# EAGLE schematic cc2538-dev-v1 (EAGLE 7.1.0)
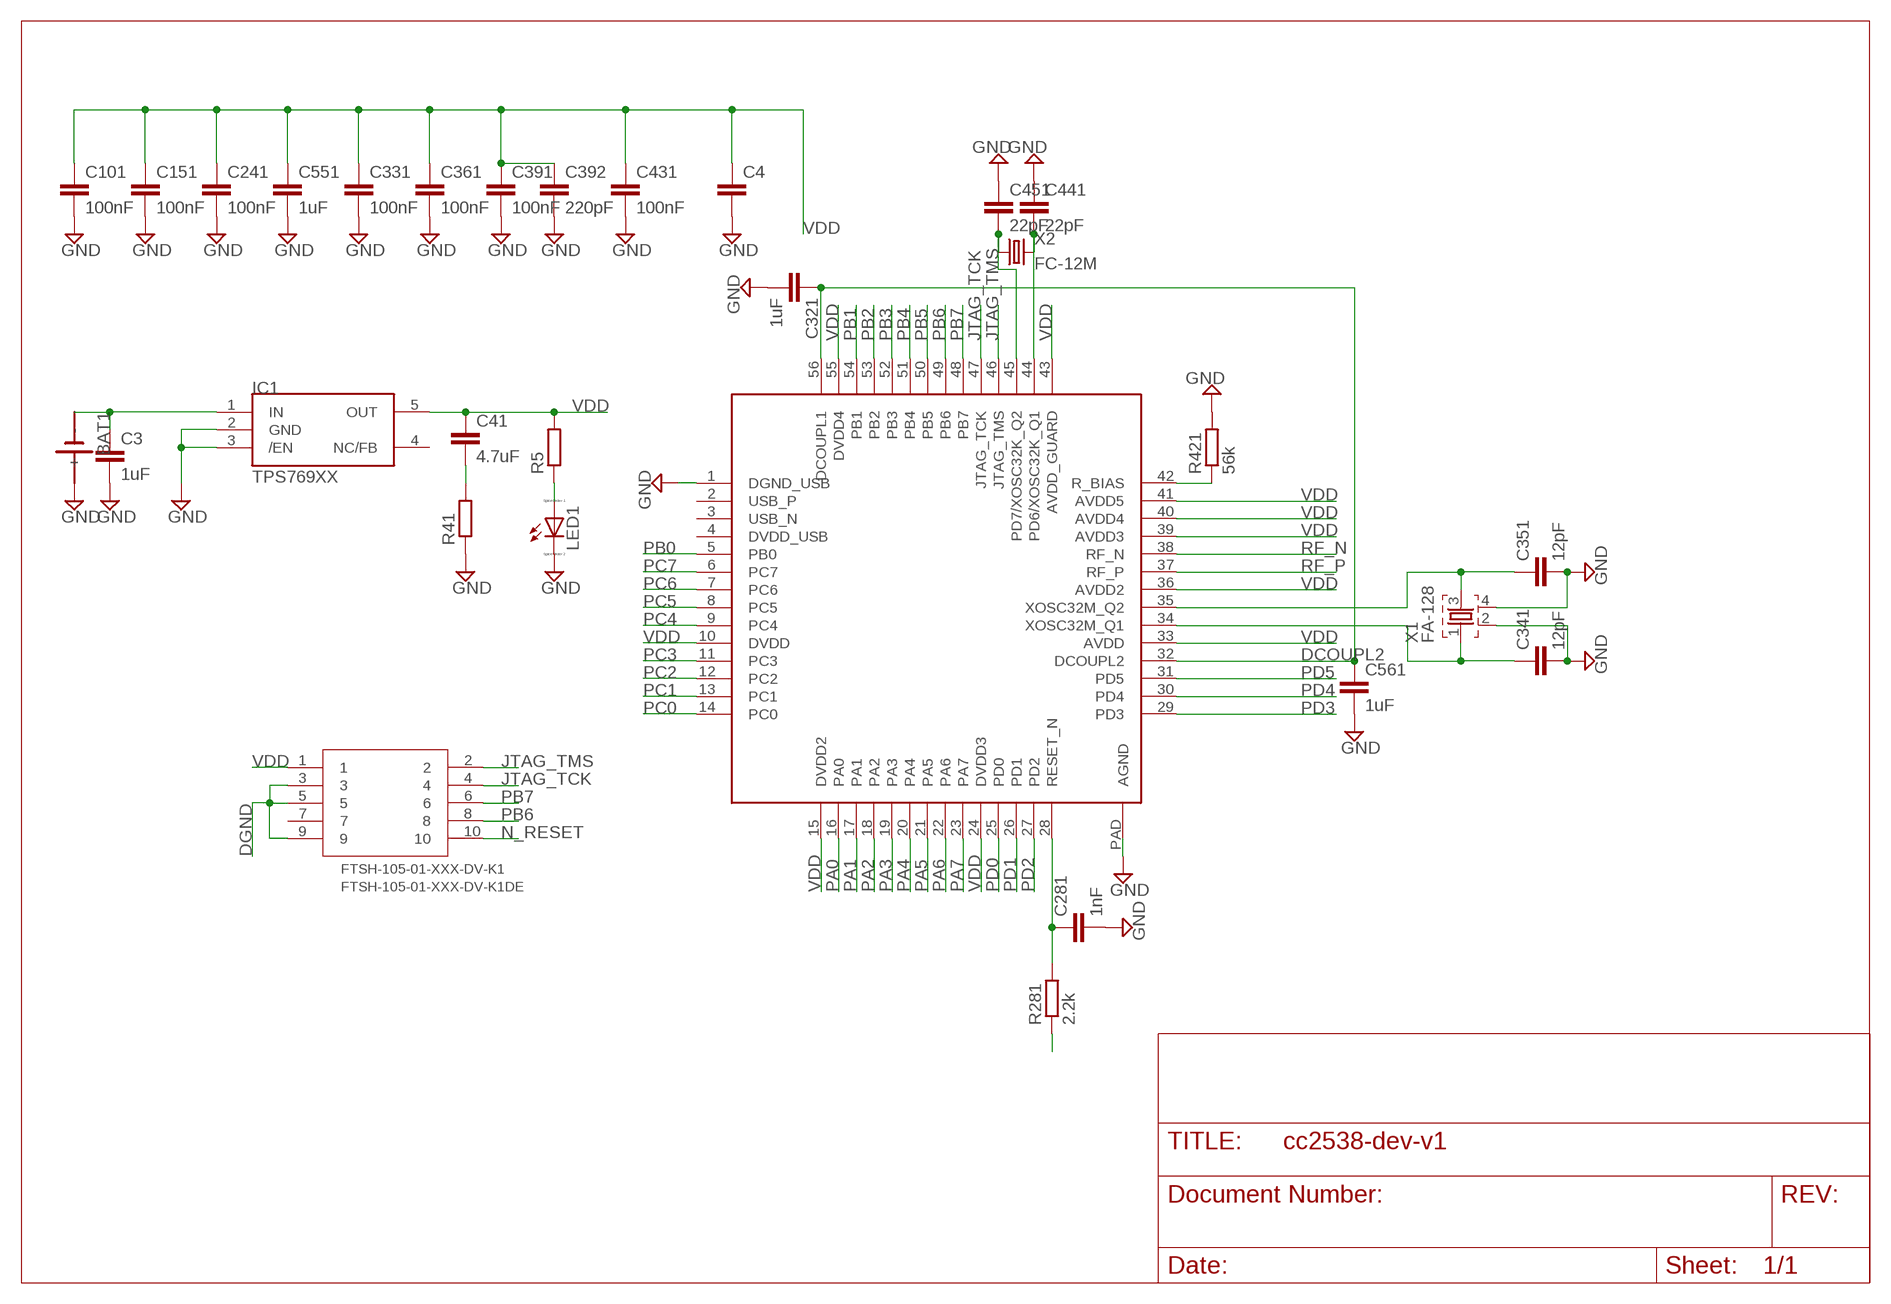
[diagram p0: schematic, sheet 1]

## Parts
BAT1  SN2032  [SN2032]
C3  1uF  C-EUC0603  [C0603]
C4  C-EUC0603  [C0603]
C41  4.7uF  C-EUC0603  [C0603]
C101  100nF  C-EUC0402  [C0402]
C151  100nF  C-EUC0402  [C0402]
C241  100nF  C-EUC0402  [C0402]
C281  1nF  C-EUC0402  [C0402]
C321  1uF  C-EUC0402  [C0402]
C331  100nF  C-EUC0402  [C0402]
C341  12pF  C-EUC0402  [C0402]
C351  12pF  C-EUC0402  [C0402]
C361  100nF  C-EUC0402  [C0402]
C391  100nF  C-EUC0402  [C0402]
C392  220pF  C-EUC0402  [C0402]
C431  100nF  C-EUC0402  [C0402]
C441  22pF  C-EUC0402  [C0402]
C451  22pF  C-EUC0402  [C0402]
C551  1uF  C-EUC0402  [C0402]
C561  1uF  C-EUC0402  [C0402]
FTSH-105-01-XXX-DV-K1  FTSH-105-01-XXX-DV-K1DE  [FTSH-105-01-XXX-DV-K]
IC1  TPS769XX  [SOT23-5L]
LED1  LED_ESML0603  [LED_SML0603]
R5  R-EU_R0603  [R0603]
R41  R-EU_R0603  [R0603]
R281  2.2k  R-EU_R0402  [R0402]
R421  56k  R-EU_R0402  [R0402]
U1  CC2538  [QFN56]
X1  FA-128  [FA-128]
X2  FC-12M  [FC-12M]

## Nets
DCOUPL2: C321.1 C561.1 U1.32(DCOUPL2) U1.56(DCOUPL1)
DGND: FTSH-105-01-XXX-DV-K1.3 FTSH-105-01-XXX-DV-K1.5 FTSH-105-01-XXX-DV-K1.9
GND: BAT1.+ C3.2 C4.2 C101.2 C151.2 C241.2 C281.2 C321.2 C331.2 C341.2 C351.2 C361.2 C391.2 C392.2 C431.2 C441.1 C451.1 C551.2 C561.2 IC1.2(GND) IC1.3(/EN) LED1.C R41.1 R421.2 U1.1(DGND_USB) U1.PAD(AGND) X1.2 X1.4
JTAG_TCK: FTSH-105-01-XXX-DV-K1.4 U1.47(JTAG_TCK)
JTAG_TMS: FTSH-105-01-XXX-DV-K1.2 U1.46(JTAG_TMS)
N$7: R421.1 U1.42(R_BIAS)
N$8: C281.1 R281.2 U1.28(RESET_N)
N$9: C341.1 U1.34(XOSC32M_Q1) X1.1
N$10: C451.2 U1.45(PD7/XOSC32K_Q2) X2.1
N$11: C441.2 U1.44(PD6/XOSC32K_Q1) X2.2
N$16: C351.1 U1.35(XOSC32M_Q2) X1.3
N$18: C41.2 R41.2
N$20: LED1.A R5.1
N$21: BAT1.- C3.1 IC1.1(IN)
N_RESET: FTSH-105-01-XXX-DV-K1.10
NRESET: R281.1
PA0: U1.16(PA0)
PA1: U1.17(PA1)
PA2: U1.18(PA2)
PA3: U1.19(PA3)
PA4: U1.20(PA4)
PA5: U1.21(PA5)
PA6: U1.22(PA6)
PA7: U1.23(PA7)
PB0: U1.5(PB0)
PB1: U1.54(PB1)
PB2: U1.53(PB2)
PB3: U1.52(PB3)
PB4: U1.51(PB4)
PB5: U1.50(PB5)
PB6: FTSH-105-01-XXX-DV-K1.8 U1.49(PB6)
PB7: FTSH-105-01-XXX-DV-K1.6 U1.48(PB7)
PC0: U1.14(PC0)
PC1: U1.13(PC1)
PC2: U1.12(PC2)
PC3: U1.11(PC3)
PC4: U1.9(PC4)
PC5: U1.8(PC5)
PC6: U1.7(PC6)
PC7: U1.6(PC7)
PD0: U1.25(PD0)
PD1: U1.26(PD1)
PD2: U1.27(PD2)
PD3: U1.29(PD3)
PD4: U1.30(PD4)
PD5: U1.31(PD5)
RF_N: U1.38(RF_N)
RF_P: U1.37(RF_P)
VDD: C4.1 C41.1 C101.1 C151.1 C241.1 C331.1 C361.1 C391.1 C392.1 C431.1 C551.1 FTSH-105-01-XXX-DV-K1.1 IC1.5(OUT) R5.2 U1.10(DVDD) U1.15(DVDD2) U1.24(DVDD3) U1.33(AVDD) U1.36(AVDD2) U1.39(AVDD3) U1.40(AVDD4) U1.41(AVDD5) U1.43(AVDD_GUARD) U1.55(DVDD4)
Unconnected: IC1.4(NC/FB) U1.2(USB_P) U1.3(USB_N) U1.4(DVDD_USB)

## Power pins joined to a net without a drawn wire
7: FTSH-105-01-XXX-DV-K1.7

## Library data of the parts
BAT1 = sn2032:SN2032: LI BATTERY
C3 C4 C41 C101 C151 C241 C281 C321 C331 C341 C351 C361 C391 C392 C431 C441 C451 C551 C561 = resistor:C-EU: CAPACITOR, European symbol
FTSH-105-01-XXX-DV-K1 = FTSH-105-01-XXX-DV-KDE:FTSH-105-01-XXX-DV-K*DE
IC1 = tps769xx:TPS769XX
LED1 = eagle-ltspice:LED_E: LED Source: http://www.osram.convergy.de Source: www.luxeon.com Source: www.kingbright.com; SPICEMODEL: NONE; SPICEPREFIX: D; SPICETYPE: diode
R5 R41 R281 R421 = resistor:R-EU_: RESISTOR, European symbol
U1 = ic:CC2538
X1 = crystal:FA-: MHz RANGE CRYSTAL UNIT Source: Epson Toyocom
X2 = crystal:FC-12M: kHz RANGE CRYSTAL UNIT LOW PROFILE SMD Source: Epson Toyocom FC-12M.pdf

## Net classes
0 default: width 0.152 mm, drill 0.305 mm, clearance 0.152 mm
1 RF: width 0.152 mm, clearance 0.152 mm